# EasyEDA Pro project PixelClock像素时钟-开源Pix24-O.eprj, board PCB
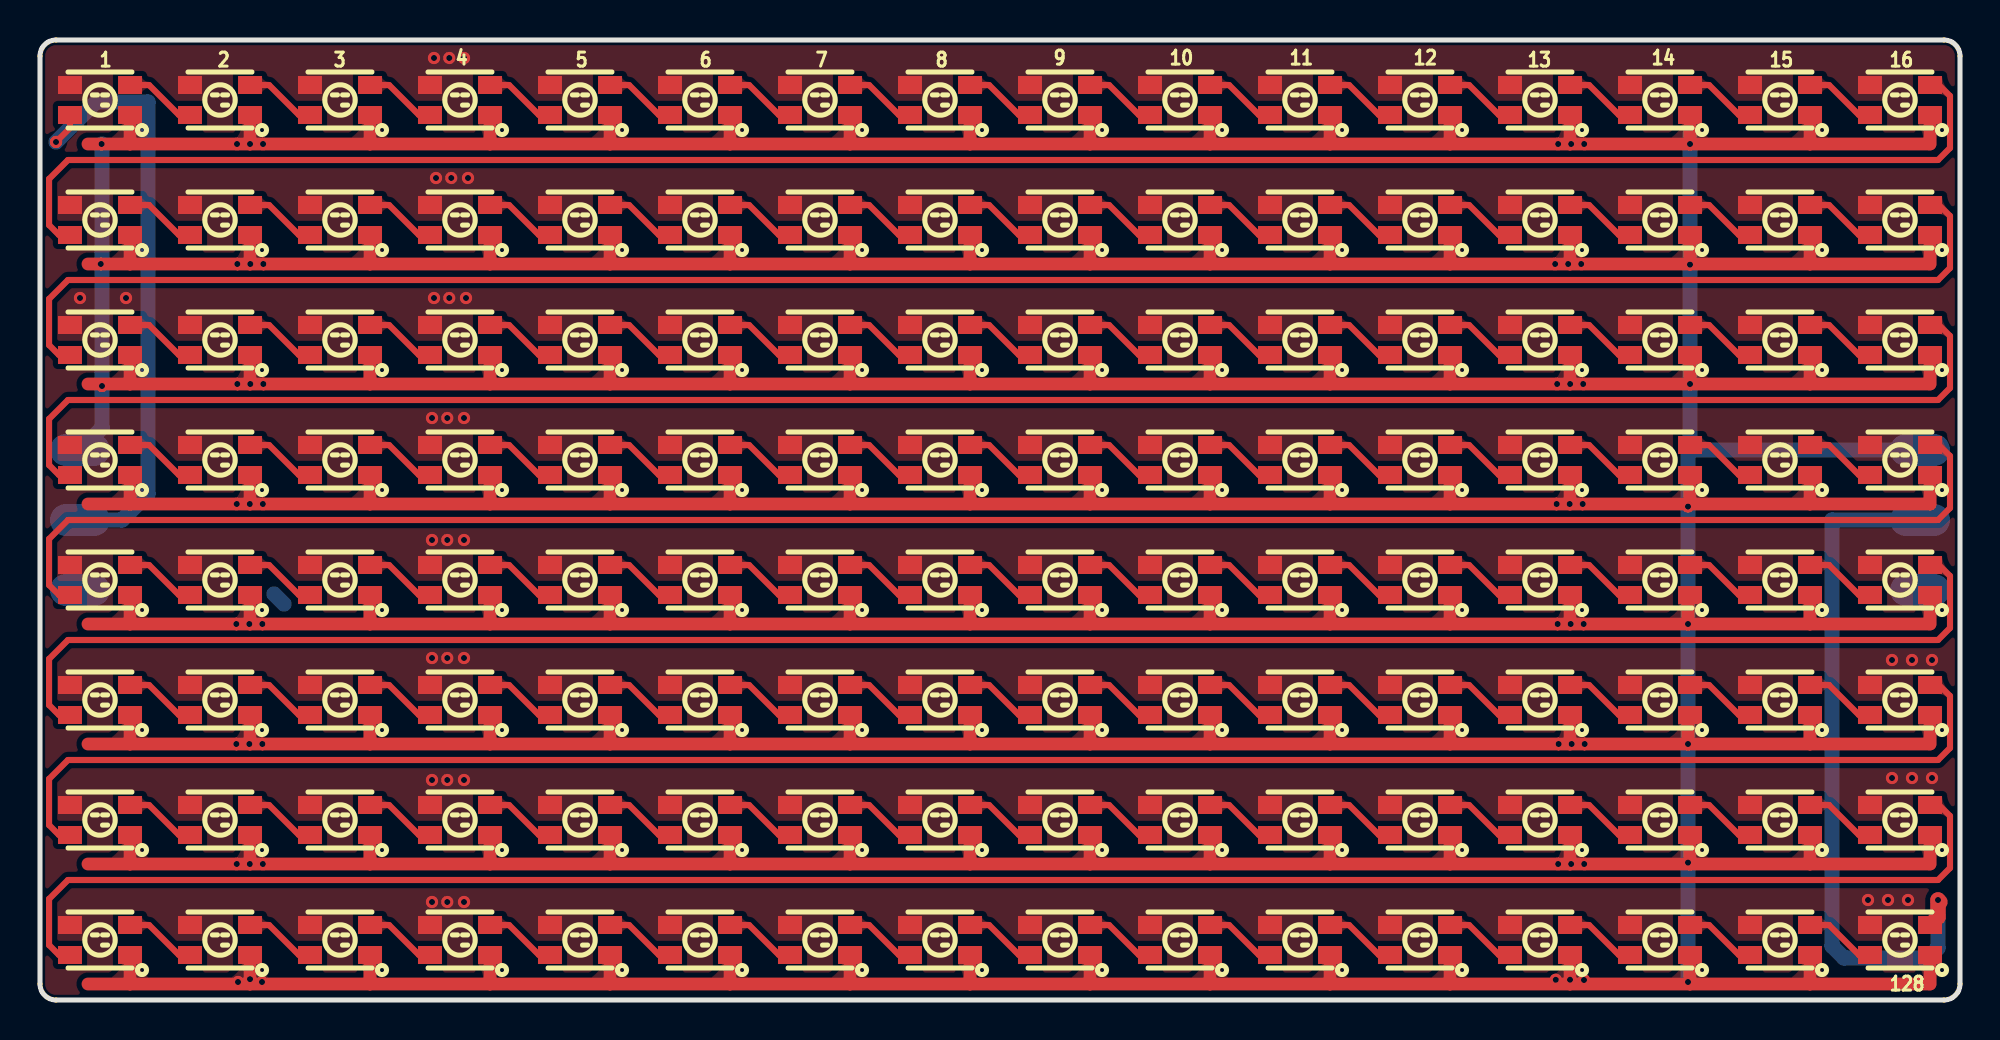
[diagram p2: board, top side]
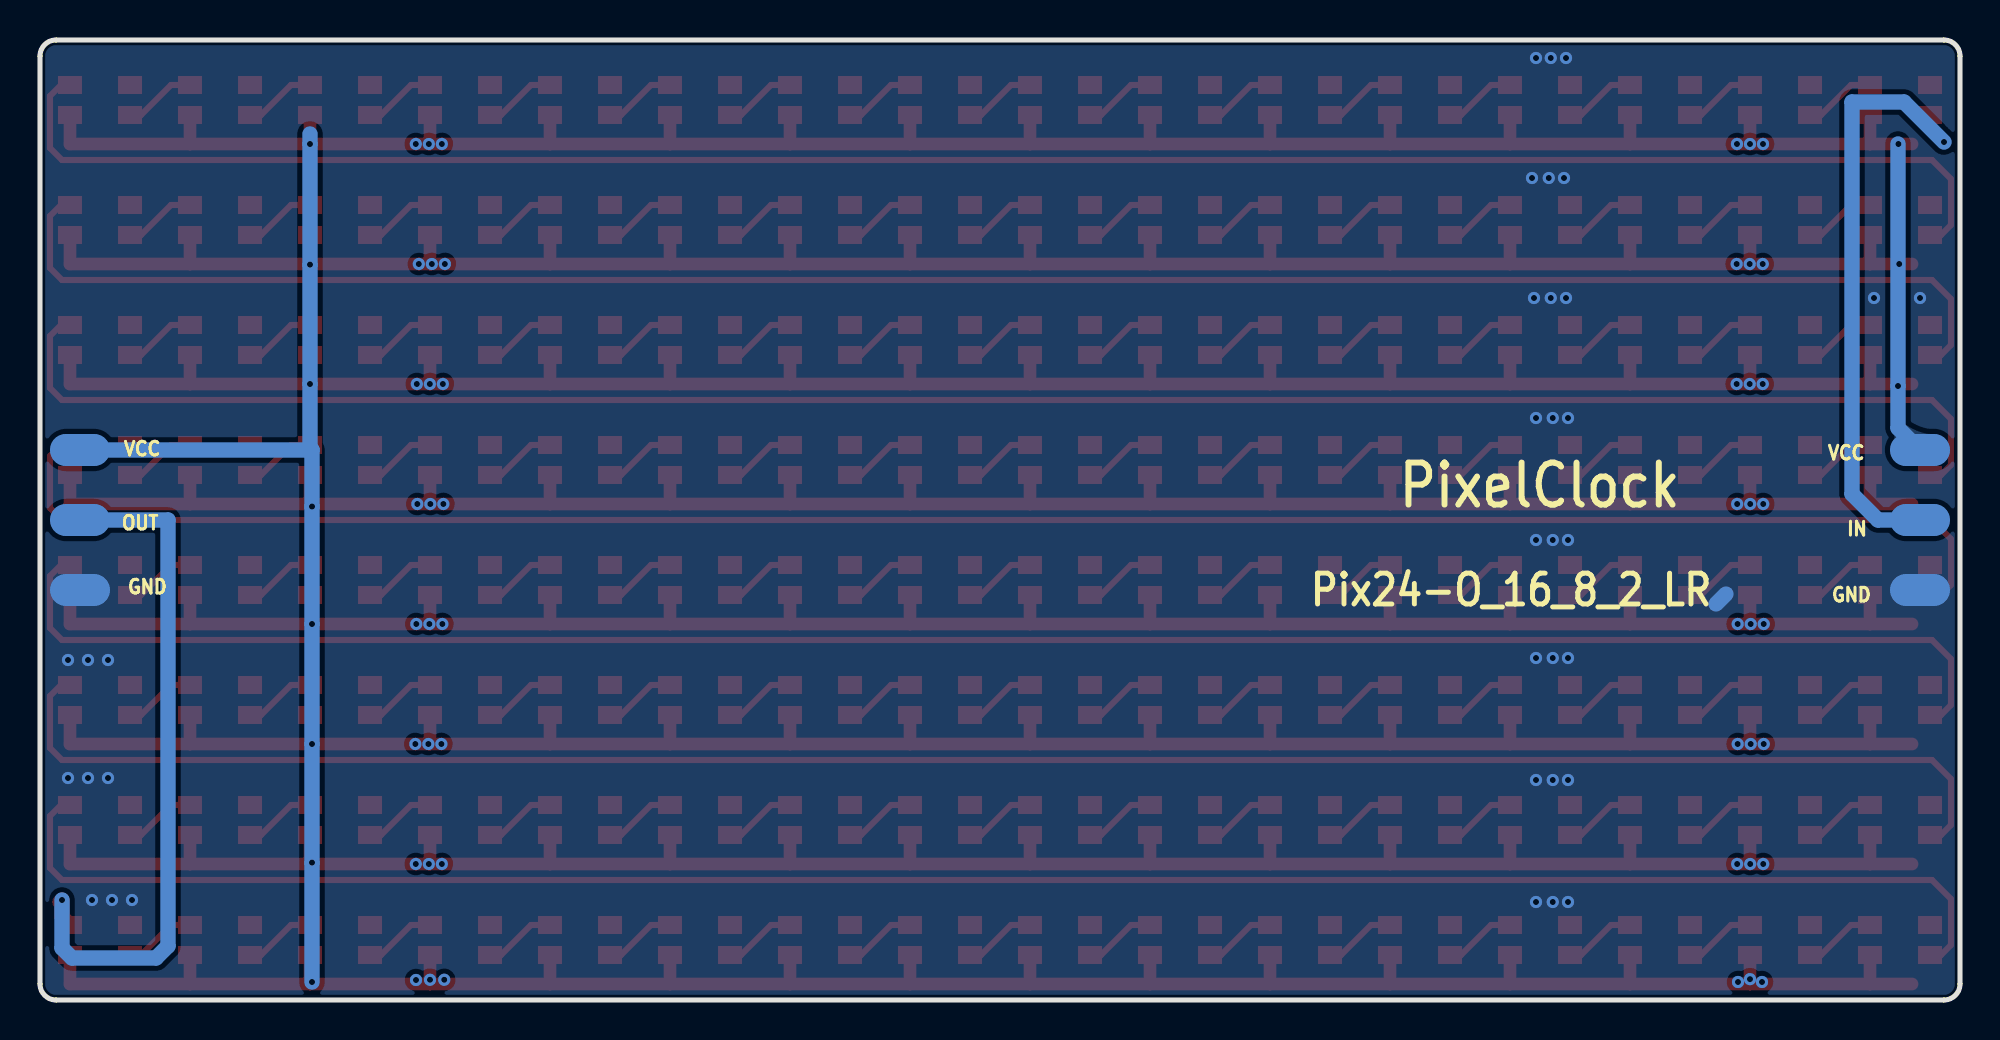
[diagram p3: board, bottom side, seen from below]

Outline 96 x 48 mm; copper layers: Top Layer, VCC, GND, Bottom Layer. Coordinates in mm from the lower left corner of the outline.
Outline path: 0,47.2 0,0.8 arc(0.23,0.23) 0.8,0 95.2,0 arc(95.77,0.23) 96,0.8 96,47.2 arc(95.77,47.77) 95.2,48 0.8,48 arc(0.23,47.77) 0,47.2
Stack: Top Layer 0.035mm 外层铜厚1oz / Dielectric1 0.2104mm 7628 RC49% 8.6mil / VCC 0.0152mm 内层铜厚 / Dielectric2 1.065mm 1.1mm H/HOZ 含铜 / GND 0.0152mm 内层铜厚 / Dielectric3 0.2104mm 7628 RC49% 8.6mil / Bottom Layer 0.035mm 外层铜厚1oz

## Design rules (mm)
template: 自定义配置
spacing copperThickness1oz (default): track to track 0.102, other pairs 0.152 to 0.3
spacing copperThickness2oz: track to track 0.203, other pairs 0.152 to 0.3
track width copperThickness1oz (default): min 0.127, default 0.254, max 2.54
track width copperThickness2oz: min 0.203, default 0.254, max 2.54
differential pair differentialPair (default): width min 0.127, default 0.254, max 2.54; gap min 0.152, default 0.152
via viaSize (default): diameter min 0.5, default 0.61, max 10; hole min 0.3, default 0.305, max 6.3

## Placement (name value [footprint] x y rotation side)
1  XL-3528RGBW-WS2812B  [LED-SMD_4P-L3.5-W2.8-BR-1]  3 45 0 top
2  XL-3528RGBW-WS2812B  [LED-SMD_4P-L3.5-W2.8-BR-1]  9 45 0 top
3  XL-3528RGBW-WS2812B  [LED-SMD_4P-L3.5-W2.8-BR-1]  15 45 0 top
4  XL-3528RGBW-WS2812B  [LED-SMD_4P-L3.5-W2.8-BR-1]  21 45 0 top
5  XL-3528RGBW-WS2812B  [LED-SMD_4P-L3.5-W2.8-BR-1]  27 45 0 top
6  XL-3528RGBW-WS2812B  [LED-SMD_4P-L3.5-W2.8-BR-1]  33 45 0 top
7  XL-3528RGBW-WS2812B  [LED-SMD_4P-L3.5-W2.8-BR-1]  39 45 0 top
8  XL-3528RGBW-WS2812B  [LED-SMD_4P-L3.5-W2.8-BR-1]  93 45 0 top
9  XL-3528RGBW-WS2812B  [LED-SMD_4P-L3.5-W2.8-BR-1]  3 39 0 top
10  XL-3528RGBW-WS2812B  [LED-SMD_4P-L3.5-W2.8-BR-1]  9 39 0 top
11  XL-3528RGBW-WS2812B  [LED-SMD_4P-L3.5-W2.8-BR-1]  15 39 0 top
12  XL-3528RGBW-WS2812B  [LED-SMD_4P-L3.5-W2.8-BR-1]  21 39 0 top
13  XL-3528RGBW-WS2812B  [LED-SMD_4P-L3.5-W2.8-BR-1]  27 39 0 top
14  XL-3528RGBW-WS2812B  [LED-SMD_4P-L3.5-W2.8-BR-1]  33 39 0 top
15  XL-3528RGBW-WS2812B  [LED-SMD_4P-L3.5-W2.8-BR-1]  39 39 0 top
16  XL-3528RGBW-WS2812B  [LED-SMD_4P-L3.5-W2.8-BR-1]  93 39 0 top
17  XL-3528RGBW-WS2812B  [LED-SMD_4P-L3.5-W2.8-BR-1]  3 33 0 top
18  XL-3528RGBW-WS2812B  [LED-SMD_4P-L3.5-W2.8-BR-1]  9 33 0 top
19  XL-3528RGBW-WS2812B  [LED-SMD_4P-L3.5-W2.8-BR-1]  15 33 0 top
20  XL-3528RGBW-WS2812B  [LED-SMD_4P-L3.5-W2.8-BR-1]  21 33 0 top
21  XL-3528RGBW-WS2812B  [LED-SMD_4P-L3.5-W2.8-BR-1]  27 33 0 top
22  XL-3528RGBW-WS2812B  [LED-SMD_4P-L3.5-W2.8-BR-1]  33 33 0 top
23  XL-3528RGBW-WS2812B  [LED-SMD_4P-L3.5-W2.8-BR-1]  39 33 0 top
24  XL-3528RGBW-WS2812B  [LED-SMD_4P-L3.5-W2.8-BR-1]  93 33 0 top
25  XL-3528RGBW-WS2812B  [LED-SMD_4P-L3.5-W2.8-BR-1]  3 27 0 top
26  XL-3528RGBW-WS2812B  [LED-SMD_4P-L3.5-W2.8-BR-1]  9 27 0 top
27  XL-3528RGBW-WS2812B  [LED-SMD_4P-L3.5-W2.8-BR-1]  15 27 0 top
28  XL-3528RGBW-WS2812B  [LED-SMD_4P-L3.5-W2.8-BR-1]  21 27 0 top
29  XL-3528RGBW-WS2812B  [LED-SMD_4P-L3.5-W2.8-BR-1]  27 27 0 top
30  XL-3528RGBW-WS2812B  [LED-SMD_4P-L3.5-W2.8-BR-1]  33 27 0 top
31  XL-3528RGBW-WS2812B  [LED-SMD_4P-L3.5-W2.8-BR-1]  39 27 0 top
32  XL-3528RGBW-WS2812B  [LED-SMD_4P-L3.5-W2.8-BR-1]  93 27 0 top
33  XL-3528RGBW-WS2812B  [LED-SMD_4P-L3.5-W2.8-BR-1]  3 21 0 top
34  XL-3528RGBW-WS2812B  [LED-SMD_4P-L3.5-W2.8-BR-1]  9 21 0 top
35  XL-3528RGBW-WS2812B  [LED-SMD_4P-L3.5-W2.8-BR-1]  15 21 0 top
36  XL-3528RGBW-WS2812B  [LED-SMD_4P-L3.5-W2.8-BR-1]  21 21 0 top
37  XL-3528RGBW-WS2812B  [LED-SMD_4P-L3.5-W2.8-BR-1]  27 21 0 top
38  XL-3528RGBW-WS2812B  [LED-SMD_4P-L3.5-W2.8-BR-1]  33 21 0 top
39  XL-3528RGBW-WS2812B  [LED-SMD_4P-L3.5-W2.8-BR-1]  39 21 0 top
40  XL-3528RGBW-WS2812B  [LED-SMD_4P-L3.5-W2.8-BR-1]  93 21 0 top
41  XL-3528RGBW-WS2812B  [LED-SMD_4P-L3.5-W2.8-BR-1]  3 15 0 top
42  XL-3528RGBW-WS2812B  [LED-SMD_4P-L3.5-W2.8-BR-1]  9 15 0 top
43  XL-3528RGBW-WS2812B  [LED-SMD_4P-L3.5-W2.8-BR-1]  15 15 0 top
44  XL-3528RGBW-WS2812B  [LED-SMD_4P-L3.5-W2.8-BR-1]  21 15 0 top
45  XL-3528RGBW-WS2812B  [LED-SMD_4P-L3.5-W2.8-BR-1]  27 15 0 top
46  XL-3528RGBW-WS2812B  [LED-SMD_4P-L3.5-W2.8-BR-1]  33 15 0 top
47  XL-3528RGBW-WS2812B  [LED-SMD_4P-L3.5-W2.8-BR-1]  39 15 0 top
48  XL-3528RGBW-WS2812B  [LED-SMD_4P-L3.5-W2.8-BR-1]  93 15 0 top
49  XL-3528RGBW-WS2812B  [LED-SMD_4P-L3.5-W2.8-BR-1]  3 9 0 top
50  XL-3528RGBW-WS2812B  [LED-SMD_4P-L3.5-W2.8-BR-1]  9 9 0 top
51  XL-3528RGBW-WS2812B  [LED-SMD_4P-L3.5-W2.8-BR-1]  15 9 0 top
52  XL-3528RGBW-WS2812B  [LED-SMD_4P-L3.5-W2.8-BR-1]  21 9 0 top
53  XL-3528RGBW-WS2812B  [LED-SMD_4P-L3.5-W2.8-BR-1]  27 9 0 top
54  XL-3528RGBW-WS2812B  [LED-SMD_4P-L3.5-W2.8-BR-1]  33 9 0 top
55  XL-3528RGBW-WS2812B  [LED-SMD_4P-L3.5-W2.8-BR-1]  39 9 0 top
56  XL-3528RGBW-WS2812B  [LED-SMD_4P-L3.5-W2.8-BR-1]  93 9 0 top
57  XL-3528RGBW-WS2812B  [LED-SMD_4P-L3.5-W2.8-BR-1]  3 3 0 top
58  XL-3528RGBW-WS2812B  [LED-SMD_4P-L3.5-W2.8-BR-1]  9 3 0 top
59  XL-3528RGBW-WS2812B  [LED-SMD_4P-L3.5-W2.8-BR-1]  15 3 0 top
60  XL-3528RGBW-WS2812B  [LED-SMD_4P-L3.5-W2.8-BR-1]  21 3 0 top
61  XL-3528RGBW-WS2812B  [LED-SMD_4P-L3.5-W2.8-BR-1]  27 3 0 top
62  XL-3528RGBW-WS2812B  [LED-SMD_4P-L3.5-W2.8-BR-1]  33 3 0 top
63  XL-3528RGBW-WS2812B  [LED-SMD_4P-L3.5-W2.8-BR-1]  39 3 0 top
64  XL-3528RGBW-WS2812B  [LED-SMD_4P-L3.5-W2.8-BR-1]  93 3 0 top
65  XL-3528RGBW-WS2812B  [LED-SMD_4P-L3.5-W2.8-BR-1]  45 45 0 top
66  XL-3528RGBW-WS2812B  [LED-SMD_4P-L3.5-W2.8-BR-1]  51 45 0 top
67  XL-3528RGBW-WS2812B  [LED-SMD_4P-L3.5-W2.8-BR-1]  57 45 0 top
68  XL-3528RGBW-WS2812B  [LED-SMD_4P-L3.5-W2.8-BR-1]  63 45 0 top
69  XL-3528RGBW-WS2812B  [LED-SMD_4P-L3.5-W2.8-BR-1]  69 45 0 top
70  XL-3528RGBW-WS2812B  [LED-SMD_4P-L3.5-W2.8-BR-1]  75 45 0 top
71  XL-3528RGBW-WS2812B  [LED-SMD_4P-L3.5-W2.8-BR-1]  81 45 0 top
72  XL-3528RGBW-WS2812B  [LED-SMD_4P-L3.5-W2.8-BR-1]  45 39 0 top
73  XL-3528RGBW-WS2812B  [LED-SMD_4P-L3.5-W2.8-BR-1]  51 39 0 top
74  XL-3528RGBW-WS2812B  [LED-SMD_4P-L3.5-W2.8-BR-1]  57 39 0 top
75  XL-3528RGBW-WS2812B  [LED-SMD_4P-L3.5-W2.8-BR-1]  63 39 0 top
76  XL-3528RGBW-WS2812B  [LED-SMD_4P-L3.5-W2.8-BR-1]  69 39 0 top
77  XL-3528RGBW-WS2812B  [LED-SMD_4P-L3.5-W2.8-BR-1]  75 39 0 top
78  XL-3528RGBW-WS2812B  [LED-SMD_4P-L3.5-W2.8-BR-1]  81 39 0 top
79  XL-3528RGBW-WS2812B  [LED-SMD_4P-L3.5-W2.8-BR-1]  45 33 0 top
80  XL-3528RGBW-WS2812B  [LED-SMD_4P-L3.5-W2.8-BR-1]  51 33 0 top
81  XL-3528RGBW-WS2812B  [LED-SMD_4P-L3.5-W2.8-BR-1]  57 33 0 top
82  XL-3528RGBW-WS2812B  [LED-SMD_4P-L3.5-W2.8-BR-1]  63 33 0 top
83  XL-3528RGBW-WS2812B  [LED-SMD_4P-L3.5-W2.8-BR-1]  69 33 0 top
84  XL-3528RGBW-WS2812B  [LED-SMD_4P-L3.5-W2.8-BR-1]  75 33 0 top
85  XL-3528RGBW-WS2812B  [LED-SMD_4P-L3.5-W2.8-BR-1]  81 33 0 top
86  XL-3528RGBW-WS2812B  [LED-SMD_4P-L3.5-W2.8-BR-1]  45 27 0 top
87  XL-3528RGBW-WS2812B  [LED-SMD_4P-L3.5-W2.8-BR-1]  51 27 0 top
88  XL-3528RGBW-WS2812B  [LED-SMD_4P-L3.5-W2.8-BR-1]  57 27 0 top
89  XL-3528RGBW-WS2812B  [LED-SMD_4P-L3.5-W2.8-BR-1]  63 27 0 top
90  XL-3528RGBW-WS2812B  [LED-SMD_4P-L3.5-W2.8-BR-1]  69 27 0 top
91  XL-3528RGBW-WS2812B  [LED-SMD_4P-L3.5-W2.8-BR-1]  75 27 0 top
92  XL-3528RGBW-WS2812B  [LED-SMD_4P-L3.5-W2.8-BR-1]  81 27 0 top
93  XL-3528RGBW-WS2812B  [LED-SMD_4P-L3.5-W2.8-BR-1]  45 21 0 top
94  XL-3528RGBW-WS2812B  [LED-SMD_4P-L3.5-W2.8-BR-1]  51 21 0 top
95  XL-3528RGBW-WS2812B  [LED-SMD_4P-L3.5-W2.8-BR-1]  57 21 0 top
96  XL-3528RGBW-WS2812B  [LED-SMD_4P-L3.5-W2.8-BR-1]  63 21 0 top
97  XL-3528RGBW-WS2812B  [LED-SMD_4P-L3.5-W2.8-BR-1]  69 21 0 top
98  XL-3528RGBW-WS2812B  [LED-SMD_4P-L3.5-W2.8-BR-1]  75 21 0 top
99  XL-3528RGBW-WS2812B  [LED-SMD_4P-L3.5-W2.8-BR-1]  81 21 0 top
100  XL-3528RGBW-WS2812B  [LED-SMD_4P-L3.5-W2.8-BR-1]  45 15 0 top
101  XL-3528RGBW-WS2812B  [LED-SMD_4P-L3.5-W2.8-BR-1]  51 15 0 top
102  XL-3528RGBW-WS2812B  [LED-SMD_4P-L3.5-W2.8-BR-1]  57 15 0 top
103  XL-3528RGBW-WS2812B  [LED-SMD_4P-L3.5-W2.8-BR-1]  63 15 0 top
104  XL-3528RGBW-WS2812B  [LED-SMD_4P-L3.5-W2.8-BR-1]  69 15 0 top
105  XL-3528RGBW-WS2812B  [LED-SMD_4P-L3.5-W2.8-BR-1]  75 15 0 top
106  XL-3528RGBW-WS2812B  [LED-SMD_4P-L3.5-W2.8-BR-1]  81 15 0 top
107  XL-3528RGBW-WS2812B  [LED-SMD_4P-L3.5-W2.8-BR-1]  45 9 0 top
108  XL-3528RGBW-WS2812B  [LED-SMD_4P-L3.5-W2.8-BR-1]  51 9 0 top
109  XL-3528RGBW-WS2812B  [LED-SMD_4P-L3.5-W2.8-BR-1]  57 9 0 top
110  XL-3528RGBW-WS2812B  [LED-SMD_4P-L3.5-W2.8-BR-1]  63 9 0 top
111  XL-3528RGBW-WS2812B  [LED-SMD_4P-L3.5-W2.8-BR-1]  69 9 0 top
112  XL-3528RGBW-WS2812B  [LED-SMD_4P-L3.5-W2.8-BR-1]  75 9 0 top
113  XL-3528RGBW-WS2812B  [LED-SMD_4P-L3.5-W2.8-BR-1]  81 9 0 top
114  XL-3528RGBW-WS2812B  [LED-SMD_4P-L3.5-W2.8-BR-1]  45 3 0 top
115  XL-3528RGBW-WS2812B  [LED-SMD_4P-L3.5-W2.8-BR-1]  51 3 0 top
116  XL-3528RGBW-WS2812B  [LED-SMD_4P-L3.5-W2.8-BR-1]  57 3 0 top
117  XL-3528RGBW-WS2812B  [LED-SMD_4P-L3.5-W2.8-BR-1]  63 3 0 top
118  XL-3528RGBW-WS2812B  [LED-SMD_4P-L3.5-W2.8-BR-1]  69 3 0 top
119  XL-3528RGBW-WS2812B  [LED-SMD_4P-L3.5-W2.8-BR-1]  75 3 0 top
120  XL-3528RGBW-WS2812B  [LED-SMD_4P-L3.5-W2.8-BR-1]  81 3 0 top
121  XL-3528RGBW-WS2812B  [LED-SMD_4P-L3.5-W2.8-BR-1]  87 45 0 top
122  XL-3528RGBW-WS2812B  [LED-SMD_4P-L3.5-W2.8-BR-1]  87 39 0 top
123  XL-3528RGBW-WS2812B  [LED-SMD_4P-L3.5-W2.8-BR-1]  87 33 0 top
124  XL-3528RGBW-WS2812B  [LED-SMD_4P-L3.5-W2.8-BR-1]  87 27 0 top
125  XL-3528RGBW-WS2812B  [LED-SMD_4P-L3.5-W2.8-BR-1]  87 21 0 top
126  XL-3528RGBW-WS2812B  [LED-SMD_4P-L3.5-W2.8-BR-1]  87 15 0 top
127  XL-3528RGBW-WS2812B  [LED-SMD_4P-L3.5-W2.8-BR-1]  87 9 0 top
128  XL-3528RGBW-WS2812B  [LED-SMD_4P-L3.5-W2.8-BR-1]  87 3 0 top
GND  -  [长圆形单面焊盘]  94 20.63 180 bottom
GND#2  -  [长圆形单面焊盘]  2 20.63 180 bottom
IN  -  [长圆形单面焊盘]  2 24.13 180 bottom
OUT  -  [长圆形单面焊盘]  94 24.13 180 bottom
VCC  -  [长圆形单面焊盘]  94 27.63 180 bottom
VCC#2  -  [长圆形单面焊盘]  2 27.63 180 bottom

## Footprints (pads in the part's own frame, mm; a bottom-side part is the same pattern mirrored in y, then rotated)
LED-SMD_4P-L3.5-W2.8-BR-1
  rect 1.199x0.899 smd: 1(1.501,-0.75) 2(1.501,0.75) 3(-1.501,0.75) 4(-1.501,-0.75)
长圆形单面焊盘
  oval 3x1.6 smd: 1(0,-0.127)

## Nets
As in the schematic, except:
GND: 1.3 2.3 3.3 4.3 5.3 6.3 7.3 8.3 9.3 10.3 11.3 12.3 13.3 14.3 15.3 16.3 17.3 18.3 19.3 20.3 21.3 22.3 23.3 24.3 25.3 26.3 27.3 28.3 29.3 30.3 31.3 32.3 33.3 34.3 35.3 36.3 37.3 38.3 39.3 40.3 41.3 42.3 43.3 44.3 45.3 46.3 47.3 48.3 49.3 50.3 51.3 52.3 53.3 54.3 55.3 56.3 57.3 58.3 59.3 60.3 61.3 62.3 63.3 64.3 65.3 66.3 67.3 68.3 69.3 70.3 71.3 72.3 73.3 74.3 75.3 76.3 77.3 78.3 79.3 80.3 81.3 82.3 83.3 84.3 85.3 86.3 87.3 88.3 89.3 90.3 91.3 92.3 93.3 94.3 95.3 96.3 97.3 98.3 99.3 100.3 101.3 102.3 103.3 104.3 105.3 106.3 107.3 108.3 109.3 110.3 111.3 112.3 113.3 114.3 115.3 116.3 117.3 118.3 119.3 120.3 121.3 122.3 123.3 124.3 125.3 126.3 127.3 128.3 GND.1 GND#2.1
VCC: 1.1 2.1 3.1 4.1 5.1 6.1 7.1 8.1 9.1 10.1 11.1 12.1 13.1 14.1 15.1 16.1 17.1 18.1 19.1 20.1 21.1 22.1 23.1 24.1 25.1 26.1 27.1 28.1 29.1 30.1 31.1 32.1 33.1 34.1 35.1 36.1 37.1 38.1 39.1 40.1 41.1 42.1 43.1 44.1 45.1 46.1 47.1 48.1 49.1 50.1 51.1 52.1 53.1 54.1 55.1 56.1 57.1 58.1 59.1 60.1 61.1 62.1 63.1 64.1 65.1 66.1 67.1 68.1 69.1 70.1 71.1 72.1 73.1 74.1 75.1 76.1 77.1 78.1 79.1 80.1 81.1 82.1 83.1 84.1 85.1 86.1 87.1 88.1 89.1 90.1 91.1 92.1 93.1 94.1 95.1 96.1 97.1 98.1 99.1 100.1 101.1 102.1 103.1 104.1 105.1 106.1 107.1 108.1 109.1 110.1 111.1 112.1 113.1 114.1 115.1 116.1 117.1 118.1 119.1 120.1 121.1 122.1 123.1 124.1 125.1 126.1 127.1 128.1 VCC.1 VCC#2.1

## Via types
v1: diameter 0.61, hole 0.305, Top Layer to Bottom Layer, 96 vias

## Routing (per net, layer and track width the routed paths; a pad name or vN(x,y) marks a point on that pad's centre or on a via; arc(x,y) is an arc through that point)
GND: length 0.7
  Bottom Layer w0.762: 12.2,19.8 11.7,20.3
  vias: v1(2,35.1) v1(4.3,35.1) v1(19.6,29.1) v1(19.6,23) v1(19.6,17.1) v1(19.6,11) v1(19.6,4.9) v1(19.7,47.1) v1(19.7,35.1) v1(19.8,41.1) v1(20.36,29.1) v1(20.36,23) v1(20.36,17.1) v1(20.36,11) v1(20.36,4.9) v1(20.46,47.1) v1(20.46,35.1) v1(20.56,41.1) v1(21.2,47.1) v1(21.2,29.1) v1(21.2,23) v1(21.2,17.1) v1(21.2,11) v1(21.2,4.9) v1(21.3,35.1) v1(21.4,41.1) v1(91.4,5) v1(92.4,5) v1(92.6,17) v1(92.6,11.1) v1(93.4,5) v1(93.6,17) v1(93.6,11.1) v1(94.6,17) v1(94.6,11.1)
VCC: length 992.4
  Top Layer w0.635: 25.1 4.5,24.8 ; 4.5,24.8 v1(9.84,24.8) 10.5,24.8 ; 4.5,24.8 2.4,24.8 ; 82.1 64.5,30.8 ; 64.5,30.8 70.5,30.8 ; 64.5,30.8 58.5,30.8 ; 22.5,42.8 28.5,42.8 ; 22.5,42.8 4.1 ; 22.5,42.8 16.5,42.8 ; 28.5,42.8 34.5,42.8 ; 28.5,42.8 5.1 ; 70.5,36.8 v1(75.76,36.8) 76.5,36.8 ; 70.5,36.8 64.5,36.8 ; 70.5,36.8 76.1 ; 29.1 28.5,24.8 ; 28.5,24.8 22.5,24.8 ; 28.5,24.8 34.5,24.8 ; 16.5,24.8 22.5,24.8 ; 16.5,24.8 27.1 ; 16.5,24.8 v1(11.14,24.8) 10.5,24.8 ; 22.5,24.8 28.1 ; 41.1 4.5,12.8 ; 4.5,12.8 2.4,12.8 ; 4.5,12.8 v1(9.81,12.8) 10.5,12.8 ; 1.1 4.5,42.8 ; 4.5,42.8 v1(9.85,42.8) v1(10.5,42.8) ; 4.5,42.8 v1(3.08,42.8) 2.4,42.8 ; 6.1 34.5,42.8 ; 34.5,42.8 40.5,42.8 ; 52.5,30.8 58.5,30.8 ; 52.5,30.8 80.1 ; 52.5,30.8 46.5,30.8 ; 58.5,30.8 81.1 ; 119.1 76.5,0.8 ; 76.5,0.8 70.5,0.8 ; 76.5,0.8 82.5,0.8 ; 76.5,36.8 v1(77.06,36.8) 82.5,36.8 ; 76.5,36.8 77.1 ; 46.5,0.8 114.1 ; 46.5,0.8 40.5,0.8 ; 46.5,0.8 52.5,0.8 ; 58.5,24.8 64.5,24.8 ; 58.5,24.8 52.5,24.8 ; 58.5,24.8 88.1 ; 64.5,24.8 89.1 ; 64.5,24.8 70.5,24.8 ; 33.1 4.5,18.8 ; 4.5,18.8 2.4,18.8 ; 4.5,18.8 v1(9.81,18.8) 10.5,18.8 ; 70.5,12.8 v1(75.93,12.8) 76.5,12.8 ; 70.5,12.8 104.1 ; 70.5,12.8 64.5,12.8 ; 67.1 58.5,42.8 ; 58.5,42.8 64.5,42.8 ; 58.5,42.8 52.5,42.8 ; 10.5,36.8 v1(11.17,36.8) 16.5,36.8 ; 10.5,36.8 v1(9.86,36.8) 4.5,36.8 ; 10.5,36.8 10.1 ; 70.5,18.8 97.1 ; 70.5,18.8 64.5,18.8 ; 70.5,18.8 v1(75.88,18.8) 76.5,18.8 ; 82.5,0.8 88.5,0.8 ; 82.5,0.8 120.1 ; 88.5,0.8 94.5,0.8 64.1 ; 88.5,0.8 128.1 ; 110.1 64.5,6.8 ; 64.5,6.8 58.5,6.8 ; 64.5,6.8 70.5,6.8 ; 51.1 16.5,6.8 ; 16.5,6.8 v1(11.14,6.8) 10.5,6.8 ; 16.5,6.8 22.5,6.8 ; 16.5,36.8 22.5,36.8 ; 16.5,36.8 11.1 ; 22.5,36.8 28.5,36.8 ; 22.5,36.8 12.1 ; 7.1 40.5,42.8 ; 40.5,42.8 46.5,42.8 ; 64.5,42.8 68.1 ; 64.5,42.8 70.5,42.8 ; 2.4,6.8 4.5,6.8 ; 4.5,6.8 v1(9.84,6.8) 10.5,6.8 ; 4.5,6.8 49.1 ; 52.5,12.8 58.5,12.8 ; 52.5,12.8 101.1 ; 52.5,12.8 46.5,12.8 ; 58.5,12.8 64.5,12.8 ; 58.5,12.8 102.1 ; 30.1 34.5,24.8 ; 34.5,24.8 40.5,24.8 ; 2.4,0.8 4.5,0.8 ; 4.5,0.8 57.1 ; 4.5,0.8 10.5,0.8 ; 88.5,12.8 94.5,12.8 48.1 ; 88.5,12.8 v1(82.4,12.8) ; 88.5,12.8 126.1 ; 40.5,30.8 46.5,30.8 ; 40.5,30.8 23.1 ; 40.5,30.8 34.5,30.8 ; 46.5,30.8 79.1 ; 88.5,36.8 94.5,36.8 16.1 ; 88.5,36.8 122.1 ; 88.5,36.8 82.5,36.8 ; 88.5,30.8 94.5,30.8 24.1 ; 88.5,30.8 v1(82.5,30.8) ; 88.5,30.8 123.1 ; 46.5,42.8 65.1 ; 46.5,42.8 52.5,42.8 ; 22.1 34.5,30.8 ; 34.5,30.8 28.5,30.8 ; 46.5,36.8 52.5,36.8 ; 46.5,36.8 40.5,36.8 ; 46.5,36.8 72.1 ; 52.5,36.8 73.1 ; 52.5,36.8 58.5,36.8 ; 21.1 28.5,30.8 ; 28.5,30.8 22.5,30.8 ; 64.5,18.8 96.1 ; 64.5,18.8 58.5,18.8 ; 76.5,18.8 98.1 ; 76.5,18.8 v1(77.18,18.8) v1(82.4,18.8) ; 62.1 34.5,0.8 ; 34.5,0.8 40.5,0.8 ; 34.5,0.8 28.5,0.8 ; 70.1 76.5,42.8 ; 76.5,42.8 v1(77.21,42.8) v1(82.5,42.8) ; 76.5,42.8 v1(75.91,42.8) 70.5,42.8 ; 70.5,0.8 64.5,0.8 ; 70.5,0.8 118.1 ; 34.5,36.8 40.5,36.8 ; 34.5,36.8 28.5,36.8 ; 34.5,36.8 14.1 ; 40.5,36.8 15.1 ; 87.1 52.5,24.8 ; 52.5,24.8 46.5,24.8 ; 32.1 94.5,24.8 88.5,24.8 ; 88.5,24.8 82.5,24.8 ; 88.5,24.8 124.1 ; 28.5,18.8 34.5,18.8 ; 28.5,18.8 37.1 ; 28.5,18.8 22.5,18.8 ; 34.5,18.8 40.5,18.8 ; 34.5,18.8 38.1 ; 70.5,42.8 69.1 ; 66.1 52.5,42.8 ; 59.1 16.5,0.8 ; 16.5,0.8 10.5,0.8 ; 16.5,0.8 22.5,0.8 ; 76.5,12.8 v1(77.23,12.8) v1(82.4,12.8) ; 76.5,12.8 105.1 ; 40.5,12.8 46.5,12.8 ; 40.5,12.8 34.5,12.8 ; 40.5,12.8 47.1 ; 46.5,12.8 100.1 ; 108.1 52.5,6.8 ; 52.5,6.8 46.5,6.8 ; 52.5,6.8 58.5,6.8 ; 63.1 40.5,0.8 ; 10.5,18.8 v1(11.12,18.8) 16.5,18.8 ; 10.5,18.8 34.1 ; 28.5,36.8 13.1 ; 46.5,6.8 107.1 ; 46.5,6.8 40.5,6.8 ; 22.5,6.8 28.5,6.8 ; 22.5,6.8 52.1 ; 28.5,6.8 34.5,6.8 ; 28.5,6.8 53.1 ; 35.1 16.5,18.8 ; 16.5,18.8 22.5,18.8 ; 64.5,36.8 58.5,36.8 ; 64.5,36.8 75.1 ; 70.5,30.8 83.1 ; 70.5,30.8 v1(75.86,30.8) 76.5,30.8 ; 46.5,18.8 93.1 ; 46.5,18.8 40.5,18.8 ; 46.5,18.8 52.5,18.8 ; 112.1 76.5,6.8 ; 76.5,6.8 v1(75.91,6.8) 70.5,6.8 ; 76.5,6.8 v1(77.21,6.8) 82.5,6.8 ; 64.5,12.8 103.1 ; 91.1 76.5,24.8 ; 76.5,24.8 v1(77.13,24.8) 82.5,24.8 ; 76.5,24.8 v1(75.83,24.8) 70.5,24.8 ; 85.1 v1(82.5,30.8) ; v1(82.5,30.8) v1(77.16,30.8) 76.5,30.8 ; 43.1 16.5,12.8 ; 16.5,12.8 22.5,12.8 ; 16.5,12.8 v1(11.12,12.8) 10.5,12.8 ; 22.5,30.8 20.1 ; 22.5,30.8 16.5,30.8 ; 64.5,0.8 117.1 ; 64.5,0.8 58.5,0.8 ; 40.5,24.8 46.5,24.8 ; 40.5,24.8 31.1 ; 46.5,24.8 86.1 ; 55.1 40.5,6.8 ; 40.5,6.8 34.5,6.8 ; 16.5,30.8 v1(11.17,30.8) 10.5,30.8 ; 16.5,30.8 19.1 ; 106.1 82.4,14.15 v1(82.4,12.8) ; 2.1 v1(10.5,42.8) ; v1(10.5,42.8) v1(11.15,42.8) 16.5,42.8 ; 28.5,12.8 34.5,12.8 ; 28.5,12.8 45.1 ; 28.5,12.8 22.5,12.8 ; 34.5,12.8 46.1 ; 58.5,6.8 109.1 ; v1(82.4,18.8) 88.5,18.8 ; v1(82.4,18.8) 82.4,20.15 99.1 ; 88.5,18.8 94.5,18.8 40.1 ; 88.5,18.8 125.1 ; 40.5,18.8 39.1 ; 94.1 52.5,18.8 ; 52.5,18.8 58.5,18.8 ; 4.5,36.8 9.1 ; 4.5,36.8 v1(3.04,36.8) 2.4,36.8 ; 10.5,0.8 58.1 ; 113.1 82.5,6.8 ; 82.5,6.8 88.5,6.8 ; 22.5,0.8 60.1 ; 22.5,0.8 28.5,0.8 ; 10.5,12.8 42.1 ; 4.5,30.8 v1(9.86,30.8) 10.5,30.8 ; 4.5,30.8 17.1 ; 4.5,30.8 2.4,30.8 ; 82.5,24.8 92.1 ; 88.5,6.8 94.5,6.8 56.1 ; 88.5,6.8 127.1 ; 10.5,24.8 26.1 ; 82.5,36.8 78.1 ; 71.1 v1(82.5,42.8) ; v1(82.5,42.8) 88.5,42.8 ; 52.5,0.8 58.5,0.8 ; 52.5,0.8 115.1 ; 28.5,0.8 61.1 ; 54.1 34.5,6.8 ; 70.5,24.8 90.1 ; 22.5,12.8 44.1 ; 58.5,0.8 116.1 ; 8.1 94.5,42.8 88.5,42.8 ; 16.5,42.8 3.1 ; 58.5,36.8 74.1 ; 22.5,18.8 36.1 ; 58.5,18.8 95.1 ; 10.5,30.8 18.1 ; 50.1 10.5,6.8 ; 70.5,6.8 111.1 ; 88.5,42.8 121.1 ; 76.5,30.8 84.1
  Bottom Layer w0.762: v1(82.4,0.9) v1(82.4,6.87) v1(82.4,12.8) v1(82.4,18.8) v1(82.4,24.67) 82.4,27.5 ; 82.5,43.3 v1(82.5,42.8) v1(82.5,36.77) v1(82.5,30.8) 82.5,27.6 82.4,27.5 ; VCC#2.1 3.1,28.6 v1(3.1,30.7) 3.1,42.8 ; 82.4,27.5 VCC.1
  vias: v1(9.9,0.9) v1(10.52,36.8) v1(10.52,30.8) v1(10.49,24.8) v1(10.47,18.8) v1(10.47,12.8) v1(10.49,6.8) v1(10.5,1.04) v1(11.1,0.9) v1(75.79,1.01) v1(76.41,36.8) v1(76.51,30.8) v1(76.48,24.8) v1(76.53,18.8) v1(76.5,1.01) v1(76.56,42.8) v1(76.58,12.8) v1(76.56,6.8) v1(77.2,1)
IN: length 30.6
  Top Layer w0.305: 1.4 1.5,43.6 v1(0.8,42.9)
  Bottom Layer w0.762: IN.1 4.1,24 5.4,25.3 5.4,44.9 2.8,44.9 v1(0.8,42.9)
LINE1: length 103.1
  Top Layer w0.305: 9.4 0.95,38.25 0.45,38.75 0.45,41.05 1.4,42 94.9,42 95.5,42.6 95.5,45.2 94.95,45.75 8.2
LINE2: length 103.1
  Top Layer w0.305: 17.4 0.95,32.25 0.45,32.75 0.45,35.05 1.4,36 94.9,36 95.5,36.6 95.5,39.2 94.95,39.75 16.2
LINE3: length 103.1
  Top Layer w0.305: 25.4 0.95,26.25 0.45,26.75 0.45,29.05 1.4,30 94.9,30 95.5,30.6 95.5,33.2 94.95,33.75 24.2
LINE4: length 103.1
  Top Layer w0.305: 33.4 0.95,20.25 0.45,20.75 0.45,23.05 1.4,24 94.9,24 95.5,24.6 95.5,27.2 94.95,27.75 32.2
LINE5: length 103.1
  Top Layer w0.305: 40.2 94.95,21.75 95.5,21.2 95.5,18.6 94.9,18 1.4,18 0.45,17.05 0.45,14.75 0.95,14.25 41.4
LINE6: length 103.1
  Top Layer w0.305: 49.4 0.95,8.25 0.45,8.75 0.45,11.05 1.4,12 94.9,12 95.5,12.6 95.5,15.2 94.95,15.75 48.2
LINE7: length 103.1
  Top Layer w0.305: 57.4 0.95,2.25 0.45,2.75 0.45,5.05 1.4,6 94.9,6 95.5,6.6 95.5,9.2 94.95,9.75 56.2
OUT: length 35.4
  Top Layer w0.762: 64.2 94.9,4.15 v1(94.9,5) 95,4.9
  Bottom Layer w0.762: OUT.1 89.6,24 89.6,2.7 90.2,2.1 94.4,2.1 94.9,2.6 v1(94.9,5)
$1N1182: length 3.6
  Top Layer w0.305: 2.4 6.95,44.25 5.45,45.75 1.2
$1N1185: length 3.6
  Top Layer w0.305: 2.2 11.45,45.75 12.95,44.25 3.4
$1N1190: length 3.6
  Top Layer w0.305: 5.4 24.95,44.25 23.45,45.75 4.2
$1N1193: length 3.6
  Top Layer w0.305: 6.4 30.95,44.25 29.45,45.75 5.2
$1N1194: length 3.6
  Top Layer w0.305: 3.2 17.45,45.75 18.95,44.25 4.4
$1N1199: length 3.6
  Top Layer w0.305: 65.4 42.95,44.25 41.45,45.75 7.2
$1N1203: length 3.6
  Top Layer w0.305: 6.2 35.45,45.75 36.95,44.25 7.4
$1N7369: length 3.6
  Top Layer w0.305: 9.2 5.45,39.75 6.95,38.25 10.4
$1N7372: length 3.6
  Top Layer w0.305: 11.4 12.95,38.25 11.45,39.75 10.2
$1N7377: length 3.6
  Top Layer w0.305: 12.2 23.45,39.75 24.95,38.25 13.4
$1N7380: length 3.6
  Top Layer w0.305: 13.2 29.45,39.75 30.95,38.25 14.4
$1N7381: length 3.6
  Top Layer w0.305: 11.2 17.45,39.75 18.95,38.25 12.4
$1N7386: length 3.6
  Top Layer w0.305: 15.2 41.45,39.75 42.95,38.25 72.4
$1N7387: length 3.6
  Top Layer w0.305: 15.4 36.95,38.25 35.45,39.75 14.2
$1N7912: length 3.6
  Top Layer w0.305: 17.2 5.45,33.75 6.95,32.25 18.4
$1N7915: length 3.6
  Top Layer w0.305: 19.4 12.95,32.25 11.45,33.75 18.2
$1N7920: length 3.6
  Top Layer w0.305: 20.2 23.45,33.75 24.95,32.25 21.4
$1N7923: length 3.6
  Top Layer w0.305: 21.2 29.45,33.75 30.95,32.25 22.4
$1N7924: length 3.6
  Top Layer w0.305: 19.2 17.45,33.75 18.95,32.25 20.4
$1N7929: length 3.6
  Top Layer w0.305: 23.2 41.45,33.75 42.95,32.25 79.4
$1N7930: length 3.6
  Top Layer w0.305: 23.4 36.95,32.25 35.45,33.75 22.2
$1N8455: length 3.6
  Top Layer w0.305: 25.2 5.45,27.75 6.95,26.25 26.4
$1N8458: length 3.6
  Top Layer w0.305: 26.2 11.45,27.75 12.95,26.25 27.4
$1N8463: length 3.6
  Top Layer w0.305: 29.4 24.95,26.25 23.45,27.75 28.2
$1N8466: length 3.6
  Top Layer w0.305: 29.2 29.45,27.75 30.95,26.25 30.4
$1N8467: length 3.6
  Top Layer w0.305: 28.4 18.95,26.25 17.45,27.75 27.2
$1N8472: length 3.6
  Top Layer w0.305: 86.4 42.95,26.25 41.45,27.75 31.2
$1N8473: length 3.6
  Top Layer w0.305: 30.2 35.45,27.75 36.95,26.25 31.4
$1N8998: length 3.6
  Top Layer w0.305: 34.4 6.95,20.25 5.45,21.75 33.2
$1N9001: length 3.6
  Top Layer w0.305: 35.4 12.95,20.25 11.45,21.75 34.2
$1N9006: length 3.6
  Top Layer w0.305: 36.2 23.45,21.75 24.95,20.25 37.4
$1N9009: length 3.6
  Top Layer w0.305: 37.2 29.45,21.75 30.95,20.25 38.4
$1N9010: length 3.6
  Top Layer w0.305: 36.4 18.95,20.25 17.45,21.75 35.2
$1N9015: length 3.6
  Top Layer w0.305: 39.2 41.45,21.75 42.95,20.25 93.4
$1N9016: length 3.6
  Top Layer w0.305: 38.2 35.45,21.75 36.95,20.25 39.4
$1N9541: length 3.6
  Top Layer w0.305: 41.2 5.45,15.75 6.95,14.25 42.4
$1N9544: length 3.6
  Top Layer w0.305: 42.2 11.45,15.75 12.95,14.25 43.4
$1N9549: length 3.6
  Top Layer w0.305: 44.2 23.45,15.75 24.95,14.25 45.4
$1N9552: length 3.6
  Top Layer w0.305: 45.2 29.45,15.75 30.95,14.25 46.4
$1N9553: length 3.6
  Top Layer w0.305: 43.2 17.45,15.75 18.95,14.25 44.4
$1N9558: length 3.6
  Top Layer w0.305: 100.4 42.95,14.25 41.45,15.75 47.2
$1N9559: length 3.6
  Top Layer w0.305: 46.2 35.45,15.75 36.95,14.25 47.4
$1N10084: length 3.6
  Top Layer w0.305: 49.2 5.45,9.75 6.95,8.25 50.4
$1N10087: length 3.6
  Top Layer w0.305: 51.4 12.95,8.25 11.45,9.75 50.2
$1N10092: length 3.6
  Top Layer w0.305: 53.4 24.95,8.25 23.45,9.75 52.2
$1N10095: length 3.6
  Top Layer w0.305: 53.2 29.45,9.75 30.95,8.25 54.4
$1N10096: length 3.6
  Top Layer w0.305: 51.2 17.45,9.75 18.95,8.25 52.4
$1N10101: length 3.6
  Top Layer w0.305: 107.4 42.95,8.25 41.45,9.75 55.2
$1N10102: length 3.6
  Top Layer w0.305: 54.2 35.45,9.75 36.95,8.25 55.4
$1N10627: length 3.6
  Top Layer w0.305: 58.4 6.95,2.25 5.45,3.75 57.2
$1N10630: length 3.6
  Top Layer w0.305: 59.4 12.95,2.25 11.45,3.75 58.2
$1N10635: length 3.6
  Top Layer w0.305: 61.4 24.95,2.25 23.45,3.75 60.2
$1N10638: length 3.6
  Top Layer w0.305: 62.4 30.95,2.25 29.45,3.75 61.2
$1N10639: length 3.6
  Top Layer w0.305: 60.4 18.95,2.25 17.45,3.75 59.2
$1N10644: length 3.6
  Top Layer w0.305: 114.4 42.95,2.25 41.45,3.75 63.2
$1N10645: length 3.6
  Top Layer w0.305: 63.4 36.95,2.25 35.45,3.75 62.2
$1N48094: length 3.6
  Top Layer w0.305: 66.4 48.95,44.25 47.45,45.75 65.2
$1N48097: length 3.6
  Top Layer w0.305: 66.2 53.45,45.75 54.95,44.25 67.4
$1N48102: length 3.6
  Top Layer w0.305: 68.2 65.45,45.75 66.95,44.25 69.4
$1N48105: length 3.6
  Top Layer w0.305: 69.2 71.45,45.75 72.95,44.25 70.4
$1N48106: length 3.6
  Top Layer w0.305: 68.4 60.95,44.25 59.45,45.75 67.2
$1N48110: length 3.6
  Top Layer w0.305: 121.4 84.95,44.25 83.45,45.75 71.2
$1N48111: length 3.6
  Top Layer w0.305: 71.4 78.95,44.25 77.45,45.75 70.2
$1N48118: length 3.6
  Top Layer w0.305: 73.4 48.95,38.25 47.45,39.75 72.2
$1N48121: length 3.6
  Top Layer w0.305: 73.2 53.45,39.75 54.95,38.25 74.4
$1N48126: length 3.6
  Top Layer w0.305: 75.2 65.45,39.75 66.95,38.25 76.4
$1N48129: length 3.6
  Top Layer w0.305: 77.4 72.95,38.25 71.45,39.75 76.2
$1N48130: length 3.6
  Top Layer w0.305: 74.2 59.45,39.75 60.95,38.25 75.4
$1N48134: length 3.6
  Top Layer w0.305: 78.2 83.45,39.75 84.95,38.25 122.4
$1N48135: length 3.6
  Top Layer w0.305: 78.4 78.95,38.25 77.45,39.75 77.2
$1N48142: length 3.6
  Top Layer w0.305: 80.4 48.95,32.25 47.45,33.75 79.2
$1N48145: length 3.6
  Top Layer w0.305: 81.4 54.95,32.25 53.45,33.75 80.2
$1N48150: length 3.6
  Top Layer w0.305: 82.2 65.45,33.75 66.95,32.25 83.4
$1N48153: length 3.6
  Top Layer w0.305: 84.4 72.95,32.25 71.45,33.75 83.2
$1N48154: length 3.6
  Top Layer w0.305: 81.2 59.45,33.75 60.95,32.25 82.4
$1N48158: length 3.6
  Top Layer w0.305: 85.2 83.45,33.75 84.95,32.25 123.4
$1N48159: length 3.6
  Top Layer w0.305: 85.4 78.95,32.25 77.45,33.75 84.2
$1N48166: length 3.6
  Top Layer w0.305: 86.2 47.45,27.75 48.95,26.25 87.4
$1N48169: length 3.6
  Top Layer w0.305: 87.2 53.45,27.75 54.95,26.25 88.4
$1N48174: length 3.6
  Top Layer w0.305: 90.4 66.95,26.25 65.45,27.75 89.2
$1N48177: length 3.6
  Top Layer w0.305: 91.4 72.95,26.25 71.45,27.75 90.2
$1N48178: length 3.6
  Top Layer w0.305: 88.2 59.45,27.75 60.95,26.25 89.4
$1N48182: length 3.6
  Top Layer w0.305: 124.4 84.95,26.25 83.45,27.75 92.2
$1N48183: length 3.6
  Top Layer w0.305: 92.4 78.95,26.25 77.45,27.75 91.2
$1N48190: length 3.6
  Top Layer w0.305: 94.4 48.95,20.25 47.45,21.75 93.2
$1N48193: length 3.6
  Top Layer w0.305: 95.4 54.95,20.25 53.45,21.75 94.2
$1N48198: length 3.6
  Top Layer w0.305: 97.4 66.95,20.25 65.45,21.75 96.2
$1N48201: length 3.6
  Top Layer w0.305: 97.2 71.45,21.75 72.95,20.25 98.4
$1N48202: length 3.6
  Top Layer w0.305: 95.2 59.45,21.75 60.95,20.25 96.4
$1N48206: length 3.6
  Top Layer w0.305: 99.2 83.45,21.75 84.95,20.25 125.4
$1N48207: length 3.6
  Top Layer w0.305: 99.4 78.95,20.25 77.45,21.75 98.2
$1N48214: length 3.6
  Top Layer w0.305: 101.4 48.95,14.25 47.45,15.75 100.2
$1N48217: length 3.6
  Top Layer w0.305: 101.2 53.45,15.75 54.95,14.25 102.4
$1N48222: length 3.6
  Top Layer w0.305: 103.2 65.45,15.75 66.95,14.25 104.4
$1N48225: length 3.6
  Top Layer w0.305: 104.2 71.45,15.75 72.95,14.25 105.4
$1N48226: length 3.6
  Top Layer w0.305: 103.4 60.95,14.25 59.45,15.75 102.2
$1N48230: length 3.6
  Top Layer w0.305: 126.4 84.95,14.25 83.45,15.75 106.2
$1N48231: length 3.6
  Top Layer w0.305: 106.4 78.95,14.25 77.45,15.75 105.2
$1N48238: length 3.6
  Top Layer w0.305: 108.4 48.95,8.25 47.45,9.75 107.2
$1N48241: length 3.6
  Top Layer w0.305: 108.2 53.45,9.75 54.95,8.25 109.4
$1N48246: length 3.6
  Top Layer w0.305: 110.2 65.45,9.75 66.95,8.25 111.4
$1N48249: length 3.6
  Top Layer w0.305: 112.4 72.95,8.25 71.45,9.75 111.2
$1N48250: length 3.6
  Top Layer w0.305: 109.2 59.45,9.75 60.95,8.25 110.4
$1N48254: length 3.6
  Top Layer w0.305: 113.2 83.45,9.75 84.95,8.25 127.4
$1N48255: length 3.6
  Top Layer w0.305: 113.4 78.95,8.25 77.45,9.75 112.2
$1N48262: length 3.6
  Top Layer w0.305: 115.4 48.95,2.25 47.45,3.75 114.2
$1N48265: length 3.6
  Top Layer w0.305: 115.2 53.45,3.75 54.95,2.25 116.4
$1N48270: length 3.6
  Top Layer w0.305: 118.4 66.95,2.25 65.45,3.75 117.2
$1N48273: length 3.6
  Top Layer w0.305: 118.2 71.45,3.75 72.95,2.25 119.4
$1N48274: length 3.6
  Top Layer w0.305: 117.4 60.95,2.25 59.45,3.75 116.2
$1N48278: length 3.6
  Top Layer w0.305: 128.4 84.95,2.25 83.45,3.75 120.2
$1N48279: length 3.6
  Top Layer w0.305: 119.2 77.45,3.75 78.95,2.25 120.4
$1N49150: length 3.6
  Top Layer w0.305: 8.4 90.95,44.25 89.45,45.75 121.2
$1N49153: length 3.6
  Top Layer w0.305: 122.2 89.45,39.75 90.95,38.25 16.4
$1N49156: length 3.6
  Top Layer w0.305: 24.4 90.95,32.25 89.45,33.75 123.2
$1N49159: length 3.6
  Top Layer w0.305: 32.4 90.95,26.25 89.45,27.75 124.2
$1N49162: length 3.6
  Top Layer w0.305: 40.4 90.95,20.25 89.45,21.75 125.2
$1N49165: length 3.6
  Top Layer w0.305: 48.4 90.95,14.25 89.45,15.75 126.2
$1N49168: length 3.6
  Top Layer w0.305: 56.4 90.95,8.25 89.45,9.75 127.2
$1N49171: length 3.6
  Top Layer w0.305: 64.4 90.95,2.25 89.45,3.75 128.2

## Copper pours and planes (outline as drawn; the poured copper is in the pictures)
GND on Top Layer: -1.1,55 98.1,55 98.1,0.2 -1.1,0.2
GND on Bottom Layer: -4,48.9 99.3,48.9 99.3,-4.4 -4,-4.4
GND on GND: 0.26,47.74 95.74,47.74 95.74,0.26 0.26,0.26
VCC on VCC: 0.26,47.74 95.74,47.74 95.74,0.26 0.26,0.26

Small or netless copper shapes (teardrops, artwork), in the pictures only: 353 on Top Layer, 4 on Bottom Layer

## Text on the board
Bottom Silkscreen Layer: Pix24-O_16_8_2_LR | PixelClock
Top Silkscreen Layer: 1 | 2 | 3 | 4 | 5 | 6 | 7 | 8 | 9 | 10 | 11 | 12 | 13 | 14 | 15 | 16 | 128
